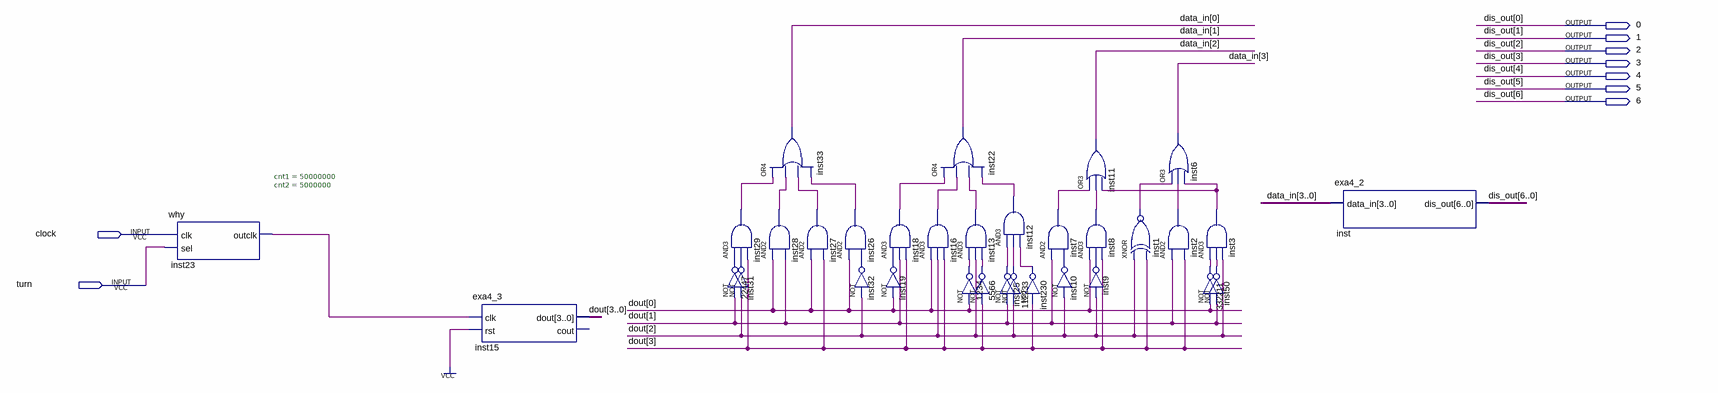
[diagram p0: schematic sheet]
// Quartus schematic 4_5.bdf as structural Verilog: 33 symbols, 9 pins
module \4_5  (
  input  clock,
  input  turn,
  output \0 ,
  output \1 ,
  output \2 ,
  output \3 ,
  output \4 ,
  output \5 ,
  output \6 
);

  wire inst1_out, inst2_out, inst3_out, inst7_out, inst8_out, inst9_out, inst10_out, inst12_out, inst13_out,
       inst16_out, inst18_out, inst19_out, inst23_outclk, inst25_out, inst26_out, inst27_out, inst28_out,
       inst29_out, inst31_out, inst32_out, inst50_out, inst230_out, n1234_out, n5566_out, n22447_out,
       n112233_out, n332211_out;
  wire [3:0] data_in, dout;

  why #(.cnt1(50000000), .cnt2(5000000)) inst23 (.clk(clock), .sel(turn), .outclk(inst23_outclk));
  exa4_3 inst15 (.clk(inst23_outclk), .rst(1'b1), .dout(dout));  // open: cout
  or inst33 (data_in[0], inst29_out, inst28_out, inst27_out, inst26_out);
  and inst28 (inst28_out, dout[0], dout[1]);
  and inst29 (inst29_out, n22447_out, inst31_out, dout[3]);
  not inst31 (inst31_out, dout[2]);
  not u_22447 (n22447_out, dout[1]);
  and inst27 (inst27_out, dout[0], dout[3]);
  and inst26 (inst26_out, dout[0], inst32_out);
  not inst32 (inst32_out, dout[2]);
  and inst18 (inst18_out, inst19_out, dout[1], dout[3]);
  not inst19 (inst19_out, dout[0]);
  or inst22 (data_in[1], inst18_out, inst16_out, inst13_out, inst12_out);
  and inst13 (inst13_out, n1234_out, dout[2], n5566_out);
  and inst16 (inst16_out, dout[0], dout[2], dout[3]);
  not u_1234 (n1234_out, dout[0]);
  and inst12 (inst12_out, inst25_out, n112233_out, inst230_out);
  not inst25 (inst25_out, dout[1]);
  not u_112233 (n112233_out, dout[2]);
  not u_5566 (n5566_out, dout[3]);
  and inst7 (inst7_out, dout[1], inst10_out);
  not inst10 (inst10_out, dout[2]);
  not inst230 (inst230_out, dout[3]);
  or inst11 (data_in[2], inst7_out, inst8_out, inst3_out);
  and inst8 (inst8_out, dout[0], inst9_out, dout[3]);
  not inst9 (inst9_out, dout[2]);
  or inst6 (data_in[3], inst1_out, inst2_out, inst3_out);
  and inst2 (inst2_out, dout[1], dout[3]);
  xnor inst1 (inst1_out, dout[2], dout[3]);
  and inst3 (inst3_out, n332211_out, inst50_out, dout[2]);
  not inst50 (inst50_out, dout[1]);
  not u_332211 (n332211_out, dout[0]);
  exa4_2 inst (.data_in(data_in), .dis_out({\6 , \5 , \4 , \3 , \2 , \1 , \0 }));

  // Other names for the same wires on the sheet: dis_out[6:0] = {\6 , \5 , \4 , \3 , \2 , \1 , \0 }
endmodule
